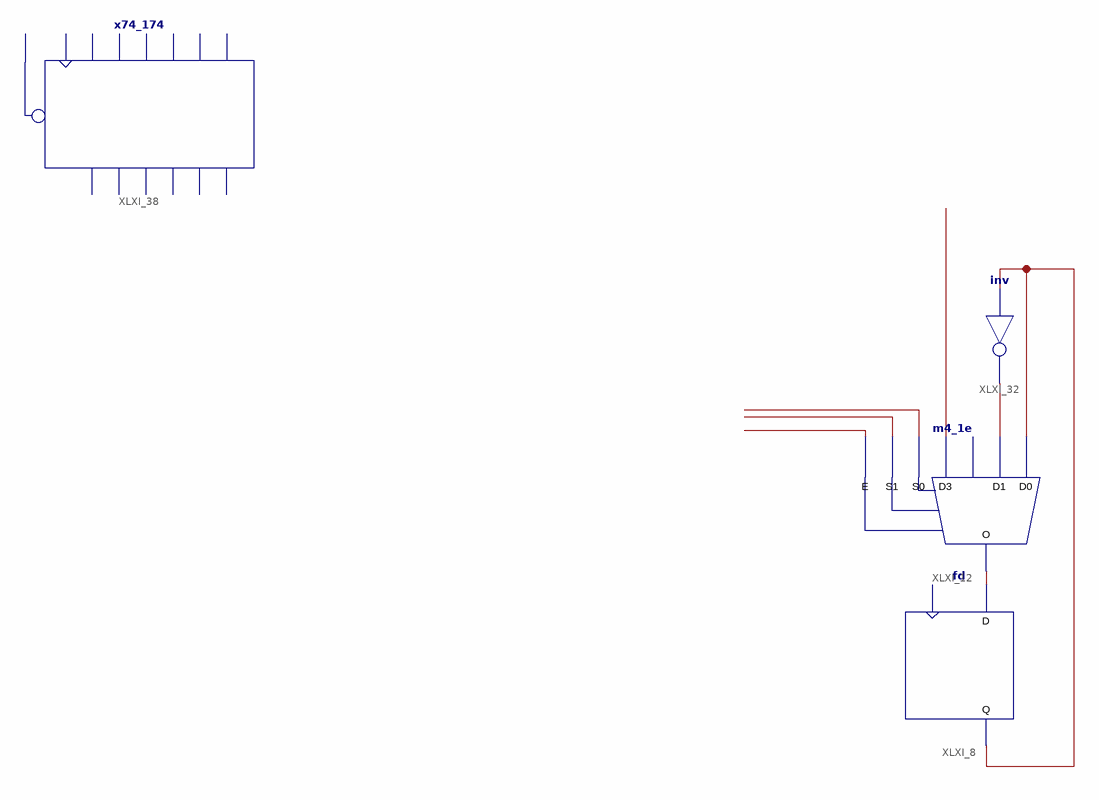
[diagram p0: schematic sheet 1]
// Xilinx ISE schematic lab10.sch (xa9500xl) as structural Verilog: 4 symbols, 0 ports
module lab10 (
);

  wire XLXN_80, XLXN_81, XLXN_85, XLXN_135, XLXN_150, XLXN_151, XLXN_152;

  fd XLXI_8 (.D(XLXN_135), .Q(XLXN_81));  // open: C
  m4_1e XLXI_12 (
    .D0(XLXN_81), .D1(XLXN_80), .D3(XLXN_85), .E(XLXN_150), .S0(XLXN_152), .S1(XLXN_151), .O(XLXN_135));  // open: D2
  not XLXI_32 (XLXN_80, XLXN_81);
  x74_174 XLXI_38 ();  // open: CK, CLR, D1, D2, D3, D4, D5, D6, Q1, Q2, Q3, Q4, Q5, Q6
endmodule
